# EAGLE design PCB1 (EAGLE 8.0.1)
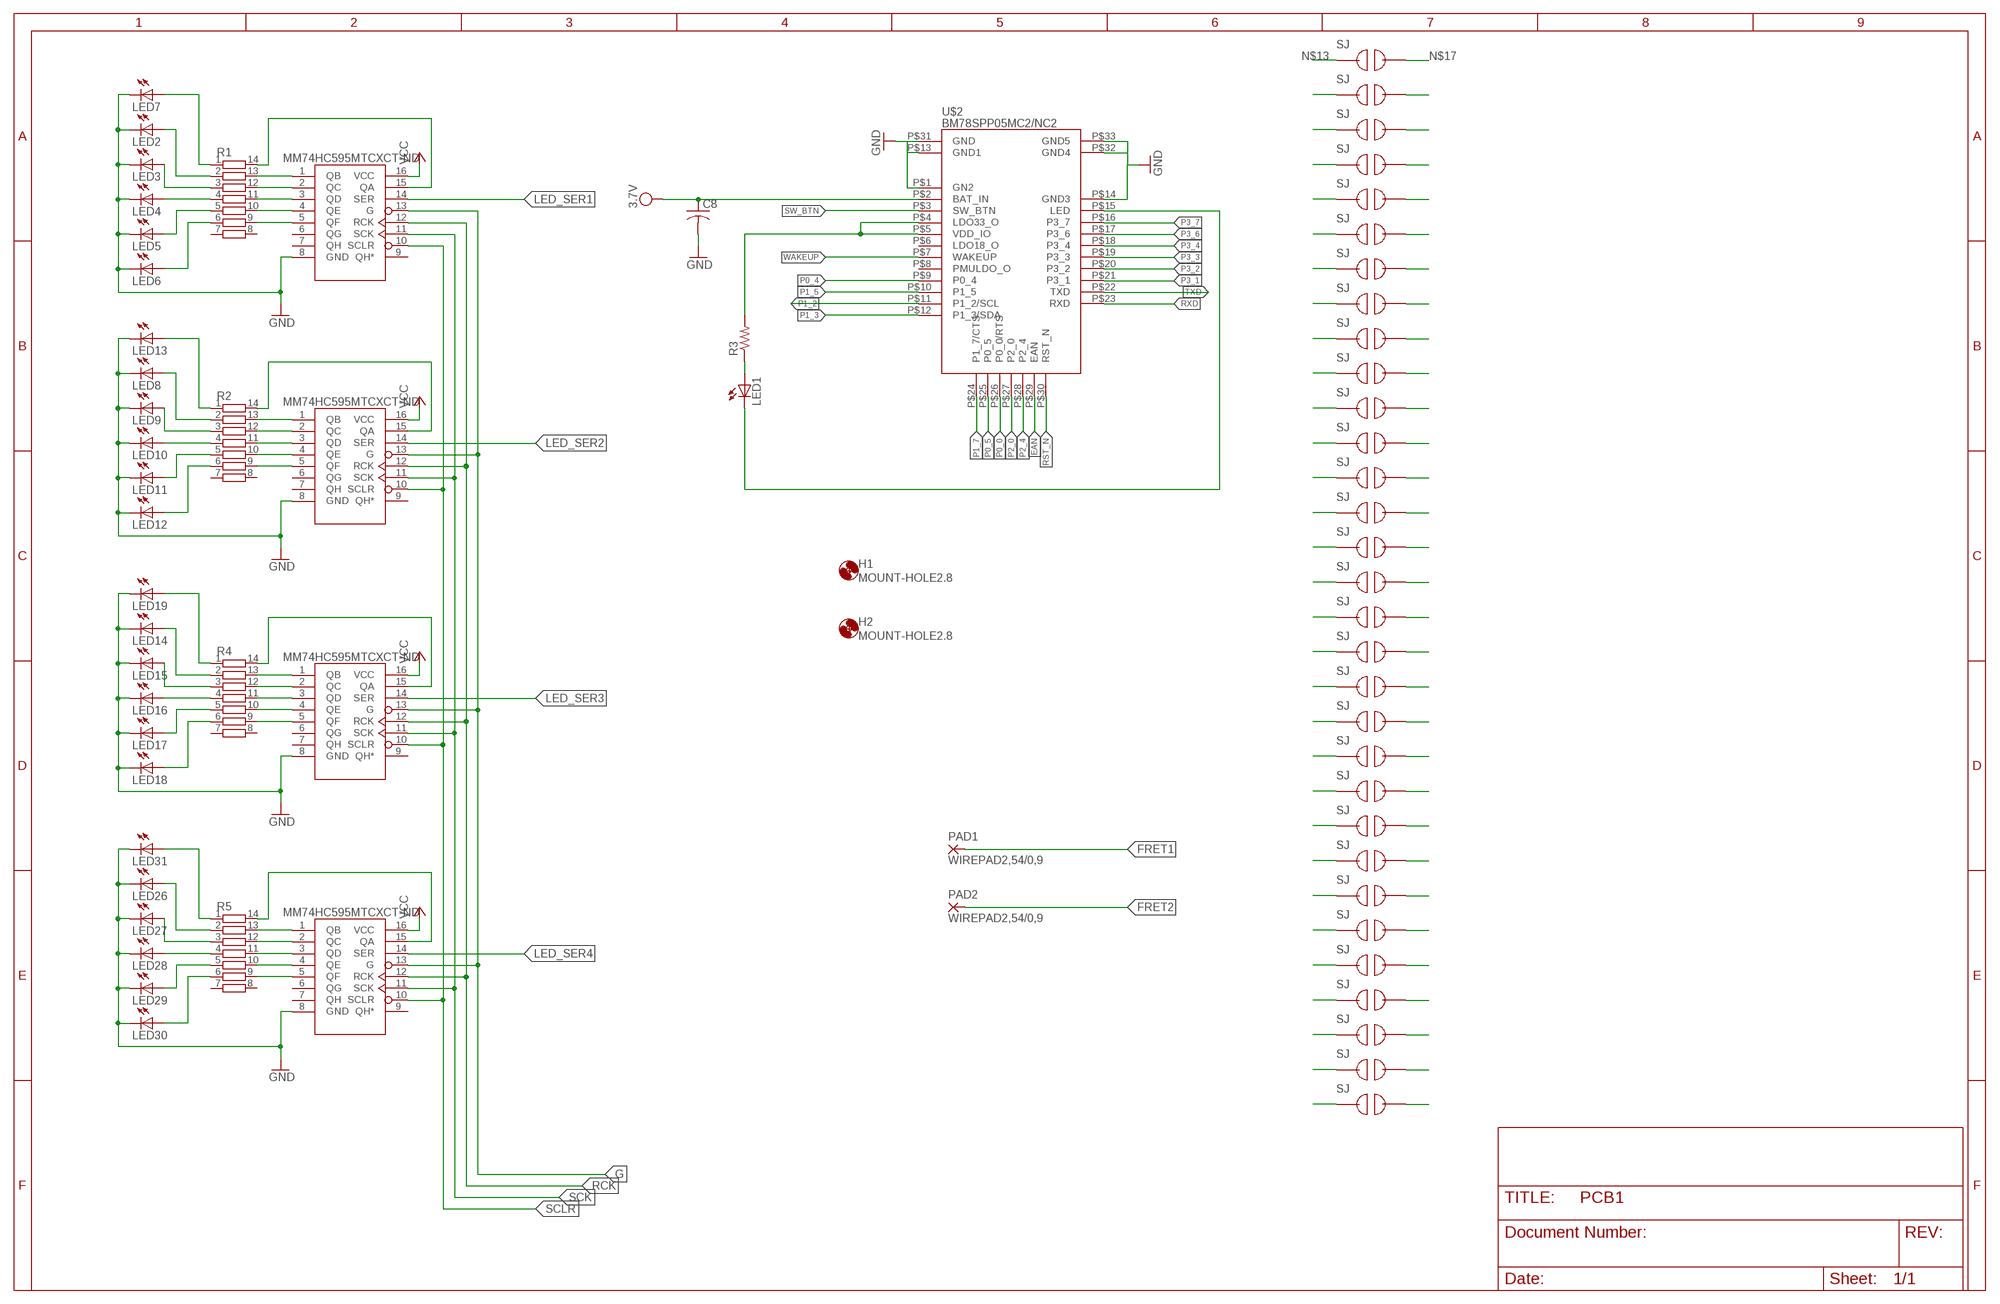
[diagram p0: schematic, sheet 1]

## Parts
C8  C-USC0805  [C0805]
H1  MOUNT-HOLE2.8  [2,8]
H2  MOUNT-HOLE2.8  [2,8]
LED1  LEDSMT1206  [1206]
LED2  LEDSMT1206  [1206]
LED3  LEDSMT1206  [1206]
LED4  LEDSMT1206  [1206]
LED5  LEDSMT1206  [1206]
LED6  LEDSMT1206  [1206]
LED7  LEDSMT1206  [1206]
LED8  LEDSMT1206  [1206]
LED9  LEDSMT1206  [1206]
LED10  LEDSMT1206  [1206]
LED11  LEDSMT1206  [1206]
LED12  LEDSMT1206  [1206]
LED13  LEDSMT1206  [1206]
LED14  LEDSMT1206  [1206]
LED15  LEDSMT1206  [1206]
LED16  LEDSMT1206  [1206]
LED17  LEDSMT1206  [1206]
LED18  LEDSMT1206  [1206]
LED19  LEDSMT1206  [1206]
LED26  LEDSMT1206  [1206]
LED27  LEDSMT1206  [1206]
LED28  LEDSMT1206  [1206]
LED29  LEDSMT1206  [1206]
LED30  LEDSMT1206  [1206]
LED31  LEDSMT1206  [1206]
PAD1  WIREPAD2,54/0,9  [2,54/0,9]
PAD2  WIREPAD2,54/0,9  [2,54/0,9]
R1  4814P-T01  [4814P]
R2  4814P-T01  [4814P]
R3  R-US_M0805  [M0805]
R4  4814P-T01  [4814P]
R5  4814P-T01  [4814P]
U$1  MM74HC595TSSOP-LD16  [MM74HC595MTCXCT-ND]
U$2  BM78SPP05MC2/NC2  [BM78SPP05MC2/NC2]
U$3  MM74HC595TSSOP-LD16  [MM74HC595MTCXCT-ND]
U$4  MM74HC595TSSOP-LD16  [MM74HC595MTCXCT-ND]
U$5  MM74HC595TSSOP-LD16  [MM74HC595MTCXCT-ND]
U$6  JUMPER  [JUMPER]
U$7  JUMPER  [JUMPER]
U$8  JUMPER  [JUMPER]
U$9  JUMPER  [JUMPER]
U$10  JUMPER  [JUMPER]
U$11  JUMPER  [JUMPER]
U$12  JUMPER  [JUMPER]
U$13  JUMPER  [JUMPER]
U$14  JUMPER  [JUMPER]
U$15  JUMPER  [JUMPER]
U$16  JUMPER  [JUMPER]
U$17  JUMPER  [JUMPER]
U$18  JUMPER  [JUMPER]
U$19  JUMPER  [JUMPER]
U$20  JUMPER  [JUMPER]
U$21  JUMPER  [JUMPER]
U$22  JUMPER  [JUMPER]
U$23  JUMPER  [JUMPER]
U$24  JUMPER  [JUMPER]
U$25  JUMPER  [JUMPER]
U$26  JUMPER  [JUMPER]
U$27  JUMPER  [JUMPER]
U$28  JUMPER  [JUMPER]
U$29  JUMPER  [JUMPER]
U$30  JUMPER  [JUMPER]
U$31  JUMPER  [JUMPER]
U$32  JUMPER  [JUMPER]
U$33  JUMPER  [JUMPER]
U$34  JUMPER  [JUMPER]
U$35  JUMPER  [JUMPER]
U$36  JUMPER  [JUMPER]

## Nets
EAN: U$2.P$29(EAN)
FRET1: PAD1.1(P)
FRET2: PAD2.1(P)
G: U$1.13(G) U$3.13(G) U$4.13(G) U$5.13(G)
GND: C8.2 LED2.C LED3.C LED4.C LED5.C LED6.C LED7.C LED8.C LED9.C LED10.C LED11.C LED12.C LED13.C LED14.C LED15.C LED16.C LED17.C LED18.C LED19.C LED26.C LED27.C LED28.C LED29.C LED30.C LED31.C U$1.8(GND) U$2.P$1(GN2) U$2.P$13(GND1) U$2.P$14(GND3) U$2.P$31(GND) U$2.P$32(GND4) U$2.P$33(GND5) U$3.8(GND) U$4.8(GND) U$5.8(GND)
LED: LED1.C U$2.P$15(LED)
LED_SER1: U$4.14(SER)
LED_SER2: U$1.14(SER)
LED_SER3: U$3.14(SER)
LED_SER4: U$5.14(SER)
N$1: R1.13 U$4.1(QB)
N$2: R1.12 U$4.2(QC)
N$3: R1.11 U$4.3(QD)
N$4: R1.10 U$4.4(QE)
N$5: R1.9 U$4.5(QF)
N$6: LED7.A R1.1
N$7: R1.14 U$4.15(QA)
N$8: LED2.A R1.2
N$9: LED3.A R1.3
N$10: LED4.A R1.4
N$11: LED5.A R1.5
N$12: LED6.A R1.6
N$13: U$35.P$1
N$15: LED1.A R3.1
N$16: R3.2 U$2.P$4(LDO33_O) U$2.P$5(VDD_IO)
N$17: U$35.P$2
N$18: U$34.P$1
N$19: R2.13 U$1.1(QB)
N$20: R2.12 U$1.2(QC)
N$21: R2.11 U$1.3(QD)
N$22: R2.10 U$1.4(QE)
N$23: R2.9 U$1.5(QF)
N$24: R2.14 U$1.15(QA)
N$25: LED13.A R2.1
N$26: LED8.A R2.2
N$27: LED9.A R2.3
N$28: LED10.A R2.4
N$29: LED11.A R2.5
N$30: LED12.A R2.6
N$31: U$34.P$2
N$32: U$33.P$2
N$33: U$33.P$1
N$34: U$6.P$1
N$35: R4.13 U$3.1(QB)
N$36: R4.12 U$3.2(QC)
N$37: R4.11 U$3.3(QD)
N$38: R4.10 U$3.4(QE)
N$39: R4.9 U$3.5(QF)
N$40: R4.14 U$3.15(QA)
N$41: LED19.A R4.1
N$42: U$7.P$1
N$43: LED14.A R4.2
N$44: LED15.A R4.3
N$45: U$8.P$1
N$46: LED16.A R4.4
N$47: LED17.A R4.5
N$49: LED18.A R4.6
N$50: U$9.P$1
N$52: U$6.P$2
N$53: U$7.P$2
N$54: U$8.P$2
N$55: U$9.P$2
N$56: U$10.P$1
N$57: U$11.P$1
N$58: U$10.P$2
N$59: U$11.P$2
N$60: R5.13 U$5.1(QB)
N$61: R5.12 U$5.2(QC)
N$62: R5.11 U$5.3(QD)
N$63: R5.10 U$5.4(QE)
N$64: R5.9 U$5.5(QF)
N$65: U$12.P$2
N$66: R5.14 U$5.15(QA)
N$67: LED31.A R5.1
N$68: LED26.A R5.2
N$69: LED27.A R5.3
N$70: LED28.A R5.4
N$71: LED29.A R5.5
N$72: LED30.A R5.6
N$73: U$12.P$1
N$74: U$13.P$1
N$75: U$13.P$2
N$76: U$14.P$2
N$77: U$14.P$1
N$78: U$15.P$1
N$79: U$15.P$2
N$80: U$16.P$2
N$81: U$17.P$2
N$82: U$18.P$2
N$83: U$19.P$2
N$84: U$20.P$2
N$85: U$21.P$2
N$86: U$22.P$2
N$87: U$23.P$2
N$88: U$24.P$2
N$89: U$25.P$2
N$90: U$26.P$2
N$91: U$27.P$2
N$92: U$28.P$2
N$93: U$29.P$2
N$94: U$30.P$2
N$95: U$31.P$2
N$96: U$32.P$2
N$97: U$36.P$2
N$98: U$36.P$1
N$99: U$32.P$1
N$100: U$31.P$1
N$101: U$30.P$1
N$102: U$29.P$1
N$103: U$28.P$1
N$104: U$27.P$1
N$105: U$26.P$1
N$106: U$25.P$1
N$107: U$24.P$1
N$108: U$23.P$1
N$109: U$22.P$1
N$110: U$21.P$1
N$111: U$20.P$1
N$112: U$19.P$1
N$113: U$18.P$1
N$114: U$17.P$1
N$115: U$16.P$1
P0_0: U$2.P$26(P0_0/RTS)
P0_4: U$2.P$9(P0_4)
P0_5: U$2.P$25(P0_5)
P1_2: U$2.P$11(P1_2/SCL)
P1_3: U$2.P$12(P1_3/SDA)
P1_5: U$2.P$10(P1_5)
P1_7: U$2.P$24(P1_7/CTS)
P2_0: U$2.P$27(P2_0)
P2_4: U$2.P$28(P2_4)
P3_1: U$2.P$21(P3_1)
P3_2: U$2.P$20(P3_2)
P3_3: U$2.P$19(P3_3)
P3_4: U$2.P$18(P3_4)
P3_6: U$2.P$17(P3_6)
P3_7: U$2.P$16(P3_7)
RCK: U$1.12(RCK) U$3.12(RCK) U$4.12(RCK) U$5.12(RCK)
RST_N: U$2.P$30(RST_N)
RXD: U$2.P$23(RXD)
SCK: U$1.11(SCK) U$3.11(SCK) U$4.11(SCK) U$5.11(SCK)
SCLR: U$1.10(SCLR) U$3.10(SCLR) U$4.10(SCLR) U$5.10(SCLR)
SW_BTN: U$2.P$3(SW_BTN)
TXD: U$2.P$22(TXD)
VCC: U$1.16(VCC) U$3.16(VCC) U$4.16(VCC) U$5.16(VCC)
VDD: C8.1 U$2.P$2(BAT_IN) ; supply symbol labelled 3.7V
WAKEUP: U$2.P$7(WAKEUP)
Unconnected: R1.7 R1.8 R2.7 R2.8 R4.7 R4.8 R5.7 R5.8 U$1.6(QG) U$1.7(QH) U$1.9(QH*) U$2.P$6(LDO18_O) U$2.P$8(PMULDO_O) U$3.6(QG) U$3.7(QH) U$3.9(QH*) U$4.6(QG) U$4.7(QH) U$4.9(QH*) U$5.6(QG) U$5.7(QH) U$5.9(QH*)

## Library data of the parts
C8 = rcl:C-US: CAPACITOR, American symbol
H1 H2 = holes:MOUNT-HOLE: MOUNTING HOLE with drill center marker
LED1-LED19 LED26-LED31 = led:LED: LED OSRAM: - CHIPLED LG R971, LG N971, LY N971, LG Q971, LY Q971, LO R971, LY R971 LH N974, LH R974 LS Q976, LO Q976, LY Q976 LO Q996 - Hyper CHIPLED LW Q18S LB Q993, LB Q99A, LB R99A - SideLED LS A670, LO A670, LY A670, LG A670, LP A670 LB A673, LV A673, LT A673, LW A673 LH A674 LY A675 LS A676, LA A676, LO A676, LY A676, LW A676 LS A679, LY A679, LG A679 - Hyper Micro SIDELED® LS Y876, LA Y876, LO Y876, LY Y876 LT Y87S - SmartLED LW L88C, LW L88S LB L89C, LB L89S, LG L890 LS L89K, LO L89K, LY L89K LS L896, LA L896, LO L896, LY L896 - TOPLED LS T670, LO T670, LY T670, LG T670, LP T670 LSG T670, LSP T670, LSY T670, LOP T670, LYG T670 LG T671, LOG T671, LSG T671 LB T673, LV T673, LT T673, LW T673 LH T674 LS T676, LA T676, LO T676, LY T676, LB T676, LH T676, LSB T676, LW T676 LB T67C, LV T67C, LT T67C, LS T67K, LO T67K, LY T67K, LW E67C LS E67B, LA E67B, LO E67B, LY E67B, LB E67C, LV E67C, LT E67C LW T67C LS T679, LY T679, LG T679 LS T770, LO T770, LY T770, LG T770, LP T770 LB T773, LV T773, LT T773, LW T773 LH T774 LS E675, LA E675, LY E675, LS T675 LS T776, LA T776, LO T776, LY T776, LB T776 LHGB T686 LT T68C, LB T68C - Hyper Mini TOPLED® LB M676 - Mini TOPLED Santana® LG M470 LS M47K, LO M47K, LY M47K Source: http://www.osram.convergy.de LUXEON: - LUMILED® LXK2-PW12-R00, LXK2-PW12-S00, LXK2-PW14-U00, LXK2-PW14-V00 LXK2-PM12-R00, LXK2-PM12-S00, LXK2-PM14-U00 LXK2-PE12-Q00, LXK2-PE12-R00, LXK2-PE12-S00, LXK2-PE14-T00, LXK2-PE14-U00 LXK2-PB12-K00, LXK2-PB12-L00, LXK2-PB12-M00, LXK2-PB14-N00, LXK2-PB14-P00, LXK2-PB14-Q00 LXK2-PR12-L00, LXK2-PR12-M00, LXK2-PR14-Q00, LXK2-PR14-R00 LXK2-PD12-Q00, LXK2-PD12-R00, LXK2-PD12-S00 LXK2-PH12-R00, LXK2-PH12-S00 LXK2-PL12-P00, LXK2-PL12-Q00, LXK2-PL12-R00 Source: www.luxeon.com KINGBRIGHT: KA-3528ASYC Source: www.kingbright.com
PAD1 PAD2 = wirepad:WIREPAD: Wire PAD connect wire on PCB
R1 R2 R4 R5 = resistor-bourns:4814P-T01: BOURNS RESISTOR NETWORK; MF: BOURNS, INC.; MPN: 4814P-T01-104LF; OC_FARNELL: 9357386; OC_NEWARK: 33K0526
R3 = rcl:R-US_: RESISTOR, American symbol
U$1 U$3-U$5 = ECE477_Guitutar:MM74HC595
U$2 = ECE477_Guitutar:BM78SPP05MC2/NC2
U$6-U$36 = ECE477_Guitutar:JUMPER

## Board
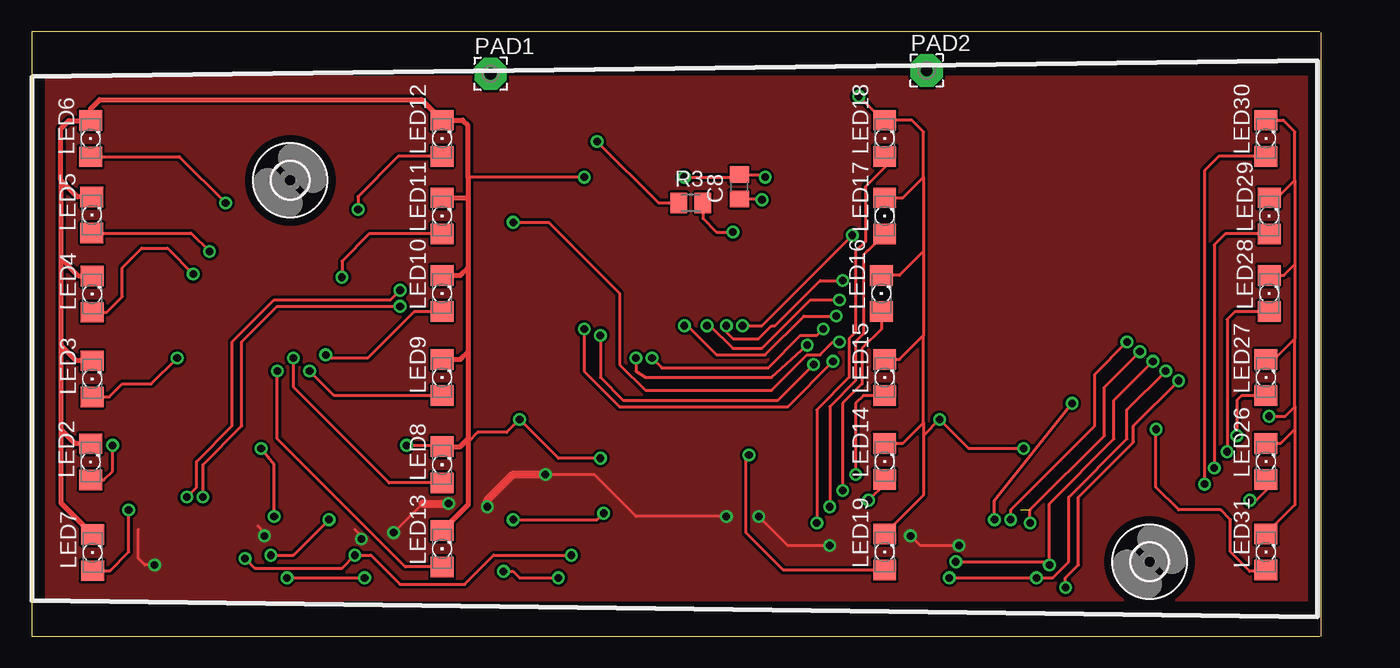
[diagram p1: board, top side]
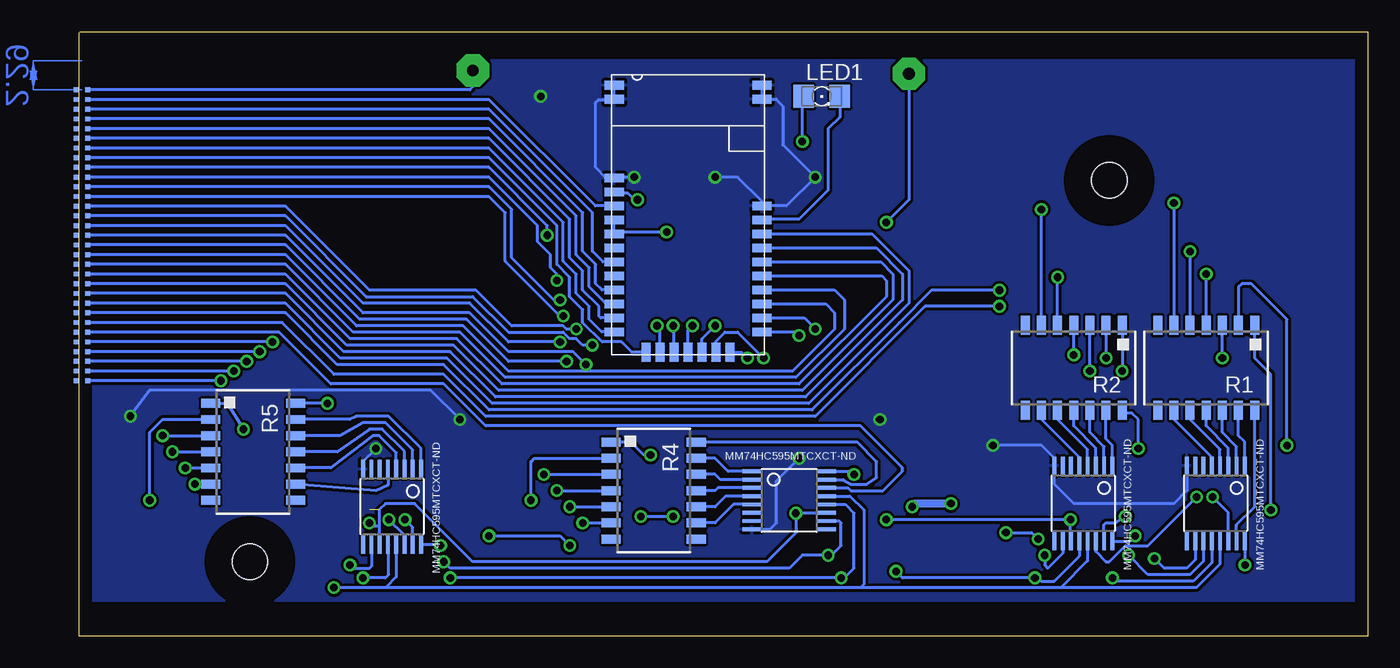
[diagram p2: board, bottom side, seen from below]

Size 101.36 x 47.49 mm. Coordinates in mm from the lower left corner, seen from the top.
Outline: 101.27,0 0,0 0,47.49 101.27,47.49
Outline: 101.34,47.42 101.36,0
Copper layers (1*16): Top 0.035mm / dielectric 1.5mm / Bottom 0.035mm
Design rules "default": minimum track width 10mil, minimum drill 24mil, track to track 8mil, track to pad 8mil, pad to pad 8mil, via to via 8mil, smd to smd 8mil, copper to edge 40mil, drill to drill 8mil, minimum pad ring 10mil, minimum via ring 8mil, stop-mask expansion 4mil, vias tented up to drill 0mil, thermal gap 10mil

### Footprints (pad centres in the part's own frame; a part is rotated, then mirrored left to right if it is on the bottom)
C0805 = smd 1.3 x 1.5: 1 -0.95,0; 2 0.95,0
2,8 = hole 2.8: 0,0
1206 = smd 1.6 x 1.803: A -1.422,0; C 1.422,0
2,54/0,9 = drill 0.914 pad 2.54 octagon: 1 0,0
4814P = smd 0.7 x 1.5: 1 -3.81,-3.346; 2 -2.54,-3.346; 3 -1.27,-3.346; 4 0,-3.346; 5 1.27,-3.346; 6 2.54,-3.346; 7 3.81,-3.346; 8 3.81,3.346; 9 2.54,3.346; 10 1.27,3.346; 11 0,3.346; 12 -1.27,3.346; 13 -2.54,3.346; 14 -3.81,3.346
M0805 = smd 1.3 x 1.6: 1 -0.95,0; 2 0.95,0
MM74HC595MTCXCT-ND = smd 0.3 x 1.45: 1 -2.275,-2.95; 2 -1.625,-2.95; 3 -0.975,-2.95; 4 -0.325,-2.95; 5 0.325,-2.95; 6 0.975,-2.95; 7 1.625,-2.95; 8 2.275,-2.95; 9 2.275,2.95; 10 1.625,2.95; 11 0.975,2.95; 12 0.325,2.95; 13 -0.325,2.95; 14 -0.975,2.95; 15 -1.625,2.95; 16 -2.275,2.95
BM78SPP05MC2/NC2 = smd 1.5 x 0.7: P$1 0.2,13.9; P$2 0.2,12.8; P$3 0.2,11.7; P$4 0.2,10.6; P$5 0.2,9.5; P$6 0.2,8.4; P$7 0.2,7.3; P$8 0.2,6.2; P$9 0.2,5.1; P$10 0.2,4; P$11 0.2,2.9; P$12 0.2,1.8; P$13 0.2,20.1; P$14 11.8,11.7; P$15 11.8,10.6; P$16 11.8,9.5; P$17 11.8,8.4; P$18 11.8,7.3; P$19 11.8,6.2; P$20 11.8,5.1; P$21 11.8,4; P$22 11.8,2.9; P$23 11.8,1.8; P$31 0.2,21.2; P$32 11.8,20.1; P$33 11.8,21.2 | smd 0.7 x 1.5: P$24 2.7,0.2; P$25 3.8,0.2; P$26 4.9,0.2; P$27 6,0.2; P$28 7.1,0.2; P$29 8.2,0.2; P$30 9.3,0.2
JUMPER = smd 0.381 x 0.381: P$1 -0.454,0; P$2 0.454,0

### Placement (x,y rotation side)
C8  55.63,35.31 90 top
H1  20.32,35.81 0 top
H2  87.88,5.84 0 top
LED1  42.93,42.42 0 bottom
LED2  4.62,13.69 90 top
LED3  4.75,20.22 90 top
LED4  4.75,26.87 90 top
LED5  4.72,33.1 90 top
LED6  4.62,39.09 90 top
LED7  4.78,6.55 90 top
LED8  32.26,13.46 90 top
LED9  32.26,20.32 90 top
LED10  32.26,26.92 90 top
LED11  32.26,33.02 90 top
LED12  32.26,39.12 90 top
LED13  32.26,6.86 90 top
LED14  67.06,13.72 90 top
LED15  67.06,20.32 90 top
LED16  66.8,26.92 90 top
LED17  67.06,33.02 90 top
LED18  67.06,39.12 90 top
LED19  67.06,6.6 90 top
LED26  97.03,13.72 90 top
LED27  97.03,20.32 90 top
LED28  97.28,26.92 90 top
LED29  97.28,33.02 90 top
LED30  97.03,39.12 90 top
LED31  97.03,6.6 90 top
PAD1  36.07,44.2 0 top
PAD2  70.36,44.45 0 top
R1  12.7,21.08 180 bottom
R2  23.11,21.08 180 bottom
R3  51.82,34.04 0 top
R4  56.13,11.43 270 bottom
R5  87.63,14.48 270 bottom
U$1  22.35,10.41 180 bottom
U$2  59.44,22.1 0 bottom
U$3  45.47,10.67 270 bottom
U$4  11.94,10.41 180 bottom
U$5  76.71,10.16 180 bottom
U$6  101.09,42.93 0 bottom
U$7  101.09,42.16 0 bottom
U$8  101.09,41.4 0 bottom
U$9  101.09,40.64 0 bottom
U$10  101.09,39.88 0 bottom
U$11  101.09,39.12 0 bottom
U$12  101.09,38.35 0 bottom
U$13  101.09,37.59 0 bottom
U$14  101.09,36.83 0 bottom
U$15  101.09,36.07 0 bottom
U$16  101.09,35.31 0 bottom
U$17  101.09,34.54 0 bottom
U$18  101.09,33.78 0 bottom
U$19  101.09,33.02 0 bottom
U$20  101.09,32.26 0 bottom
U$21  101.09,31.5 0 bottom
U$22  101.09,30.73 0 bottom
U$23  101.09,29.97 0 bottom
U$24  101.09,29.21 0 bottom
U$25  101.09,28.45 0 bottom
U$26  101.09,27.69 0 bottom
U$27  101.09,26.92 0 bottom
U$28  101.09,26.16 0 bottom
U$29  101.09,25.4 0 bottom
U$30  101.09,24.64 0 bottom
U$31  101.09,23.88 0 bottom
U$32  101.09,23.11 0 bottom
U$33  101.09,22.35 0 bottom
U$34  101.09,21.59 0 bottom
U$35  101.09,20.83 0 bottom
U$36  101.09,20.07 0 bottom

### Tracks (layer width: path | path; a pad name or v marks a point on that pad's centre or on a via)
EAN  (via drill 0.6)
  Top 0.254: v47.5,21.84 47.5,20.83 48.26,20.32 58.17,20.32 v60.96,22.86
  Bottom 0.254: U$2.P$29 51.24,23.19 50.55,23.88 49.53,23.88 v47.5,21.84 | 100.58,33.02 85.09,33.02 78.74,26.67 70.36,26.67 67.56,23.88 63.25,23.88 62.74,23.37 62.23,23.37 61.72,22.86 v60.96,22.86
FRET1  (via drill 0.6)
  Top 0.254: v37.85,32.51 40.64,32.51 46.23,26.92 46.23,21.34 48.26,19.3 58.17,19.3 60.96,22.1 61.98,22.1 62.99,23.11 v63.5,23.11
  Bottom 0.254: PAD1.1 36.07,34.29 v37.85,32.51 | v63.5,23.11 67.56,23.11 70.61,26.16 78.99,26.16 85.09,32.26 100.58,32.26
FRET2
  Bottom 0.254: PAD2.1 70.36,43.18 70.61,42.93 100.58,42.93
G  (via drill 0.6)
  Top 0.254: v81.28,3.81 81.28,4.57 82.3,5.59 82.3,10.92 86.61,15.24 86.61,16.51 v90.17,20.07
  Bottom 0.254: U$4.13 11.61,5.66 13.46,3.81 24.13,3.81 | U$1.13 22.03,5.91 24.13,3.81 | U$3.13 40.71,10.99 39.62,9.91 39.62,4.06 39.88,3.81 | 24.13,3.81 39.88,3.81 | 39.88,3.81 77.22,3.81 | U$5.13 76.38,4.64 77.22,3.81 | v90.17,20.07 100.58,20.07 | 77.22,3.81 v81.28,3.81
GND  (via drill 0.6)
  Top 0.254: 70.1,16.76 70.1,23.62 | 70.1,30.23 70.1,23.62 | 70.1,36.07 70.1,30.23 | 70.1,36.07 70.1,39.62 69.19,40.54 LED18.C 66.9,40.54 v65.02,42.42 | 70.1,16.76 70.1,15.75 | 70.1,15.75 70.1,11.07 LED19.C | LED14.C 68.48,15.14 70.1,16.76 | LED15.C 68.22,21.74 70.1,23.62 | LED16.C 68.22,28.35 70.1,30.23 | LED17.C 68.48,34.44 70.1,36.07 | v57.66,36.07 57.47,36.26 C8.2 55.44,36.07 v51.31,36.07 | v43.43,36.07 34.29,36.07 | v29.46,14.99 32.16,14.99 LED8.C | v44.7,13.97 41.4,13.97 v38.35,17.02 37.34,16 35.05,16 34.29,15.24 | LED30.C 98.4,40.54 99.31,39.62 99.31,35.81 | 99.31,18.03 99.31,23.37 | 99.31,18.03 99.31,16.26 | 99.31,29.21 99.31,23.37 | 99.31,35.81 99.31,29.21 | 99.31,16.26 99.31,10.31 LED31.C | LED26.C 98.2,15.14 99.31,16.26 | LED27.C 97.69,21.74 99.31,23.37 | LED28.C 98.45,28.35 99.31,29.21 | LED29.C 97.94,34.44 99.31,35.81 | v97.28,17.27 98.55,17.27 99.31,18.03 | 70.1,15.75 v71.37,17.02 73.66,14.73 v77.98,14.73
  Top 0.406: 2.29,22.86 2.29,16.26 | 2.29,29.72 2.29,22.86 | 2.29,35.81 2.29,29.72 | 2.29,35.81 2.29,39.88 2.92,40.51 LED6.C 4.62,41.45 5.33,42.16 30.63,42.16 LED12.C 33.88,40.54 34.29,40.13 34.29,36.07 34.29,34.29 | 2.29,16.26 2.29,10.46 LED7.C | LED2.C 3.43,15.11 2.29,16.26 | LED3.C 3.51,21.64 2.29,22.86 | LED4.C 3.71,28.3 2.29,29.72 | LED5.C 3.58,34.52 2.29,35.81 | 34.29,22.35 34.29,15.49 | 34.29,28.96 34.29,22.35 | 34.29,34.29 34.29,28.96 | 34.29,15.49 34.29,15.24 34.29,10.31 LED13.C | LED8.C 33.68,14.88 34.29,15.49 | LED9.C 33.68,21.74 34.29,22.35 | LED10.C 33.68,28.35 34.29,28.96 | LED11.C 34.14,34.44 34.29,34.29
  Bottom 0.254: U$4.8 14.21,11.44 15.24,10.41 23.11,10.41 24.64,11.94 U$1.8 24.63,13.96 25.65,14.99 v29.46,14.99 | v57.66,36.07 59.17,36.07 U$2.P$1 59.87,36 60.71,36.83 60.71,41.91 60.45,42.16 59.27,42.16 U$2.P$13 U$2.P$31 | U$2.P$33 U$2.P$32 46.52,42.2 45.97,41.66 45.97,38.61 v43.43,36.07 45.7,33.8 U$2.P$14 47.64,34.17 49.53,36.07 v51.31,36.07 | U$3.8 46.98,8.39 46.48,8.89 46.48,12.19 v44.7,13.97 | U$5.8 78.98,13.73 v77.98,14.73 | v97.28,17.27 95.76,19.3 73.66,19.3 v71.37,17.02
  pour Bottom: 0,45.21 101.09,45.21 101.09,2.79 0,2.79
LED
  Bottom 0.254: LED1.C 41.5,40.79 42.42,39.88 42.42,35.05 44.7,32.77 47.57,32.77 U$2.P$15
LED_SER1  (via drill 0.6)
  Top 0.254: v12.19,10.92 12.95,11.68 12.95,13.72 15.75,16.51 15.75,23.11 19.05,26.42 28.19,26.42 v28.96,27.18
  Bottom 0.254: U$4.14 10.96,9.69 v12.19,10.92 | v28.96,27.18 34.29,27.18 36.83,24.64 43.69,17.78 69.09,17.78 72.64,21.34 81.03,21.34 85.09,25.4 100.58,25.4
LED_SER2  (via drill 0.6)
  Top 0.254: v13.46,10.92 13.46,13.46 16.51,16.51 16.51,23.11 19.3,25.91 v28.96,25.91
  Bottom 0.254: U$1.14 21.38,6.64 20.57,5.84 20.32,5.84 19.05,7.11 17.27,7.11 v13.46,10.92 | v28.96,25.91 34.8,25.91 43.43,17.27 69.34,17.27 72.64,20.57 81.28,20.57 85.34,24.64 100.58,24.64
LED_SER3
  Bottom 0.254: U$3.14 40.85,11.64 40.64,11.43 38.1,11.43 36.58,12.95 36.58,13.21 39.88,16.51 69.34,16.51 72.64,19.81 81.53,19.81 85.6,23.88 100.58,23.88
LED_SER4  (via drill 0.6)
  Top 0.254: v76.96,9.14 76.96,9.91 83.57,16.51 83.57,20.57 v86.11,23.11
  Bottom 0.254: U$5.14 75.73,7.92 v76.96,9.14 | v86.11,23.11 100.58,23.11
N$1
  Bottom 0.254: U$4.1 9.66,15.25 10.16,15.75 R1.13
N$2
  Bottom 0.254: U$4.2 10.31,14.88 11.43,16 R1.12
N$3
  Bottom 0.254: U$4.3 10.96,14.77 12.7,16.51 R1.11
N$4
  Bottom 0.254: U$4.4 11.61,14.66 13.97,17.02 R1.10
N$5
  Bottom 0.254: U$4.5 12.26,14.04 15.24,17.02 R1.9
N$6  (via drill 0.6)
  Top 0.254: LED7.A 6.15,5.13 7.62,6.6 v7.62,9.91
  Bottom 0.254: v7.62,9.91 7.62,20.57 8.89,21.84 R1.1
N$7
  Bottom 0.254: U$4.15 10.31,8.74 8.89,10.16 R1.14
N$8  (via drill 0.6)
  Top 0.254: LED2.A 5.67,12.27 6.35,12.95 v6.35,14.99
  Bottom 0.254: v6.35,14.99 6.35,24.89 9.14,27.69 9.91,27.69 10.16,27.43 R1.2
N$9  (via drill 0.6)
  Top 0.254: LED3.A 6.1,18.8 7.11,19.81 9.4,19.81 v11.43,21.84
  Bottom 0.254: v11.43,21.84 R1.3
N$10  (via drill 0.6)
  Top 0.254: LED4.A 5.89,25.45 7.11,26.67 7.11,28.96 8.64,30.48 10.67,30.48 v12.7,28.45
  Bottom 0.254: R1.4 v12.7,28.45
N$11  (via drill 0.6)
  Top 0.254: LED5.A 12.52,31.67 v13.97,30.23
  Bottom 0.254: v13.97,30.23 R1.5
N$12  (via drill 0.6)
  Top 0.254: LED6.A 11.61,37.67 v15.24,34.04
  Bottom 0.254: v15.24,34.04 R1.6
N$15  (via drill 0.6)
  Top 0.254: v44.45,38.86 49.28,34.04 R3.1
  Bottom 0.254: v44.45,38.86 44.45,42.32 LED1.A
N$16  (via drill 0.6)
  Top 0.254: R3.2 52.77,32.83 53.85,31.75 v55.12,31.75
  Bottom 0.254: U$2.P$4 U$2.P$5 59.08,31.75 v55.12,31.75
N$19
  Bottom 0.254: U$1.1 20.08,15 20.57,15.49 R2.13
N$20
  Bottom 0.254: U$1.2 20.73,14.88 21.84,16 R2.12
N$21
  Bottom 0.254: U$1.3 21.38,14.77 23.11,16.51 R2.11
N$22
  Bottom 0.254: U$1.4 22.03,14.66 24.38,17.02 R2.10
N$23
  Bottom 0.254: U$1.5 22.68,14.04 25.65,17.02 R2.9
N$24  (via drill 0.6)
  Top 0.254: v19.05,9.4 19.05,13.46 v18.03,14.73
  Bottom 0.254: U$1.15 20.73,8.74 20.57,8.89 19.81,8.89 v19.05,9.4 | v18.03,14.73 18.03,17.02 18.54,17.53 19.09,17.53 R2.14
N$25  (via drill 0.6)
  Top 0.254: LED13.A 29.36,5.44 19.3,15.49 v19.3,20.83
  Bottom 0.254: R2.1 v19.3,20.83
N$26  (via drill 0.6)
  Top 0.254: LED8.A 28.09,12.04 20.57,19.56 v20.57,21.84
  Bottom 0.254: R2.2 v20.57,21.84
N$27  (via drill 0.6)
  Top 0.254: LED9.A 23.77,18.9 v21.84,20.83
  Bottom 0.254: v21.84,20.83 R2.3
N$28  (via drill 0.6)
  Top 0.254: LED10.A 30.07,25.5 26.42,21.84 23.37,21.84 v23.11,22.1
  Bottom 0.254: v23.11,22.1 R2.4
N$29  (via drill 0.6)
  Top 0.254: LED11.A 26.52,31.6 24.38,29.46 v24.38,28.19
  Bottom 0.254: R2.5 v24.38,28.19
N$30  (via drill 0.6)
  Top 0.254: LED12.A 28.8,37.69 25.65,34.54 v25.65,33.53
  Bottom 0.254: R2.6 v25.65,33.53
N$35
  Bottom 0.254: U$3.1 50.28,12.94 51.31,13.97 R4.13
N$36
  Bottom 0.254: U$3.2 50.9,12.29 51.31,12.7 R4.12
N$37
  Bottom 0.254: U$3.3 51.09,11.64 51.31,11.43 R4.11
N$38
  Bottom 0.254: U$3.4 50.48,10.99 51.31,10.16 R4.10
N$39
  Bottom 0.254: U$3.5 49.85,10.34 51.31,8.89 R4.9
N$40
  Bottom 0.254: U$3.15 41.25,12.29 40.64,11.94 39.37,11.94 38.61,12.45 38.61,13.72 40.13,15.24 R4.14
N$41  (via drill 0.6)
  Top 0.254: LED19.A 59.08,5.18 56.13,8.13 56.13,13.97 v56.39,14.22
  Bottom 0.254: v56.39,14.22 56.9,14.22 57.91,15.24 R4.1
N$43  (via drill 0.6)
  Top 0.254: LED14.A 67.06,11.94 v65.79,10.67
  Bottom 0.254: v65.79,10.67 65.79,13.72 65.53,13.97 R4.2
N$44  (via drill 0.6)
  Top 0.254: LED15.A 65.38,18.9 64.77,18.29 v64.77,12.7
  Bottom 0.254: v64.77,12.7 R4.3
N$46  (via drill 0.6)
  Top 0.254: v63.75,11.43 63.75,18.29 65.28,19.81 65.28,22.61 66.8,24.13 LED16.A
  Bottom 0.254: v63.75,11.43 R4.4
N$47  (via drill 0.6)
  Top 0.254: v62.74,10.16 62.74,18.03 64.77,20.07 64.77,23.11 65.41,23.75 65.41,29.97 65.79,30.35 65.81,30.35 LED17.A
  Bottom 0.254: v62.74,10.16 R4.5
N$49  (via drill 0.6)
  Top 0.254: v61.72,8.89 61.72,17.78 64.26,20.32 64.26,23.37 64.77,23.88 64.77,30.23 65.53,30.99 65.53,35.31 67.06,36.83 | 67.06,36.83 LED18.A 67.06,36.83
  Bottom 0.254: v61.72,8.89 R4.6
N$60
  Bottom 0.254: U$5.1 74.43,14.74 76.96,17.27 79.5,17.27 80.01,17.02 R5.13
N$61
  Bottom 0.254: U$5.2 75.08,14.63 77.22,16.76 78.99,16.76 80.77,15.75 R5.12
N$62
  Bottom 0.254: U$5.3 75.73,14.52 77.47,16.26 78.49,16.26 81.03,14.48 R5.11
N$63
  Bottom 0.254: U$5.4 76.38,14.41 77.72,15.75 78.23,15.75 81.53,13.21 R5.10
N$64
  Bottom 0.254: U$5.5 77.03,11.87 77.98,11.43 R5.9
N$66  (via drill 0.6)
  Top 0.254: v75.69,9.14 75.69,10.67 v81.79,18.29
  Bottom 0.254: U$5.15 75.08,8.54 v75.69,9.14 | v81.79,18.29 R5.14
N$67  (via drill 0.6)
  Top 0.254: LED31.A 96.93,5.08 95.76,5.08 94.23,6.6 94.23,9.14 93.47,9.91 90.17,9.91 88.39,11.68 v88.39,16.26
  Bottom 0.254: R5.1 89.66,18.29 v88.39,16.26
N$68  (via drill 0.6)
  Top 0.254: LED26.A 97.03,11.43 96.27,10.67 v95.76,10.67
  Bottom 0.254: v95.76,10.67 95.76,16 94.74,17.02 R5.2
N$69  (via drill 0.6)
  Top 0.254: LED27.A 95.1,18.9 94.74,18.54 v94.74,15.75
  Bottom 0.254: v94.74,15.75 R5.3
N$70  (via drill 0.6)
  Top 0.254: LED28.A 94.59,25.5 93.98,24.89 v93.98,14.48
  Bottom 0.254: v93.98,14.48 R5.4
N$71  (via drill 0.6)
  Top 0.254: LED29.A 93.83,31.6 92.96,30.73 v92.96,13.21
  Bottom 0.254: v92.96,13.21 R5.5
N$72  (via drill 0.6)
  Top 0.254: LED30.A 93.32,37.69 92.2,36.58 v92.2,11.94
  Bottom 0.254: v92.2,11.94 R5.6
P0_0  (via drill 0.6)
  Top 0.254: v54.61,24.38 54.61,23.88 55.12,23.37 57.15,23.37 58.17,24.38 58.42,24.38 61.98,27.94 v63.75,27.94
  Bottom 0.254: U$2.P$26 54.54,24.31 v54.61,24.38 | v63.75,27.94 63.75,28.45 64.26,28.96 64.26,29.97 65.28,30.99 65.28,32.26 69.09,36.07 100.58,36.07
P0_4
  Bottom 0.254: U$2.P$9 60.22,27.2 60.71,27.69 60.71,29.21 61.72,30.23 61.72,33.27 69.09,40.64 100.58,40.64
P0_5  (via drill 0.6)
  Top 0.254: v55.88,24.38 57.4,24.38 v64.52,31.5
  Bottom 0.254: U$2.P$25 55.64,24.14 v55.88,24.38 | v64.52,31.5 64.52,32.26 69.09,36.83 100.58,36.83
P1_2
  Bottom 0.254: U$2.P$11 60.3,25 60.45,25.15 60.45,25.91 61.72,27.18 61.72,28.7 62.74,29.72 62.74,32.77 69.09,39.12 100.58,39.12
P1_3
  Bottom 0.254: U$2.P$12 60.22,23.9 61.21,24.89 61.21,25.91 62.23,26.92 62.23,28.45 63.25,29.46 63.25,32.51 69.09,38.35 100.58,38.35
P1_5
  Bottom 0.254: U$2.P$10 59.88,26.1 61.21,27.43 61.21,28.96 62.23,29.97 62.23,33.02 69.09,39.88 100.58,39.88
P1_7
  Bottom 0.254: U$2.P$24 57.86,22.3 58.67,23.11 60.2,23.11 61.72,24.64 61.72,25.65 62.74,26.67 62.74,28.19 63.75,29.21 63.75,32.26 69.09,37.59 100.58,37.59
P2_0  (via drill 0.6)
  Top 0.254: v53.09,24.38 53.34,24.38 55.12,22.61 57.4,22.61 61.21,26.42 v63.5,26.42
  Bottom 0.254: U$2.P$27 53.44,24.03 v53.09,24.38 | v63.5,26.42 64.01,26.42 67.31,29.72 67.31,33.53 69.09,35.31 100.58,35.31
P2_4  (via drill 0.6)
  Top 0.254: v51.31,24.38 51.56,24.38 53.85,22.1 57.66,22.1 60.71,25.15 v63.25,25.15
  Bottom 0.254: U$2.P$28 52.34,23.36 v51.31,24.38 | v63.25,25.15 63.5,25.15 67.82,29.46 67.82,33.27 69.09,34.54 100.58,34.54
P3_1
  Bottom 0.254: U$2.P$21 42.61,26.1 41.91,25.4 41.91,24.13 45.21,20.83 67.56,20.83 71.12,24.38 79.5,24.38 85.09,29.97 100.58,29.97
P3_2
  Bottom 0.254: U$2.P$20 41.93,27.2 41.15,26.42 41.15,24.13 44.96,20.32 67.82,20.32 71.37,23.88 79.76,23.88 85.09,29.21 100.58,29.21
P3_3
  Bottom 0.254: U$2.P$19 38.2,28.3 37.85,27.94 37.85,26.67 44.7,19.81 68.07,19.81 71.63,23.37 80.01,23.37 85.09,28.45 100.58,28.45
P3_4
  Bottom 0.254: U$2.P$18 38.29,29.4 37.34,28.45 37.34,26.42 44.45,19.3 68.33,19.3 71.88,22.86 80.26,22.86 85.09,27.69 100.58,27.69
P3_6
  Bottom 0.254: U$2.P$17 38.63,30.5 36.58,28.45 36.58,26.42 44.2,18.8 68.58,18.8 72.14,22.35 80.52,22.35 85.09,26.92 100.58,26.92
P3_7
  Bottom 0.254: U$2.P$16 38.96,31.6 36.07,28.7 36.07,26.16 43.94,18.29 68.83,18.29 72.39,21.84 80.77,21.84 85.09,26.16 100.58,26.16
RCK  (via drill 0.6)
  Top 0.254: v20.07,4.57 v26.16,4.57 | v37.08,5.08 37.85,5.08 38.35,4.57 v41.4,4.57 | v72.14,4.57 v78.99,4.57 80.26,4.57 81.53,5.84 81.53,10.92 86.11,15.49 86.11,17.78 v89.15,20.83
  Bottom 0.254: U$4.12 12.26,5.77 13.72,4.32 19.81,4.32 v20.07,4.57 | U$1.12 22.68,6.28 24.64,4.32 25.65,4.32 25.91,4.57 v26.16,4.57 36.58,4.57 v37.08,5.08 | U$3.12 41.08,10.34 40.39,9.65 40.39,5.33 41.15,4.57 v41.4,4.57 v72.14,4.57 | v78.99,4.57 77.22,4.57 76.96,4.83 76.96,7.14 U$5.12 | v89.15,20.83 100.58,20.83
RST_N  (via drill 0.6)
  Top 0.254: v48.77,21.84 49.53,21.08 57.91,21.08 60.45,23.62 61.72,23.62 v62.23,24.13
  Bottom 0.254: U$2.P$30 49.22,22.3 v48.77,21.84 | 100.58,33.78 85.09,33.78 78.49,27.18 70.1,27.18 67.31,24.38 63.25,24.38 62.99,24.13 v62.23,24.13
RXD  (via drill 0.6)
  Top 0.254: v44.7,23.62 44.7,20.32 46.48,18.54 58.67,18.54 v61.47,21.34
  Bottom 0.254: U$2.P$23 44.98,23.9 v44.7,23.62 | v61.47,21.34 62.48,22.35 67.56,22.35 70.61,25.4 78.99,25.4 85.09,31.5 100.58,31.5
SCK  (via drill 0.6)  (1 unrouted)
  Top 0.254: v18.8,6.35 20.57,6.35 v23.37,9.14 | v37.85,9.14 44.45,9.14 v44.96,9.65 | v78.49,8.89 78.49,9.91 84.33,15.75 84.33,19.56 v87.12,22.35
  Bottom 0.254: U$4.11 12.91,5.88 13.97,4.83 17.27,4.83 v18.8,6.35 | U$1.11 23.37,7.5 v23.37,9.14 v37.85,9.14 | U$3.11 42.56,9.65 v44.96,9.65 44.96,8.13 47.24,5.84 70.36,5.84 74.93,10.41 77.22,10.41 77.72,9.91 77.72,7.25 | 77.72,7.25 U$5.11 77.72,7.25 | 77.72,8.64 78.23,8.64 v78.49,8.89 | v87.12,22.35 100.58,22.35
SCLR  (via drill 0.6)
  Top 0.254: v16.76,6.1 17.53,5.33 24.38,5.33 v25.4,6.35 26.67,6.35 28.96,4.06 34.04,4.06 36.32,6.35 v42.42,6.35 | v72.64,5.84 79.76,5.84 v80.01,5.59 80.01,10.41 85.09,15.49 85.09,18.54 v88.14,21.59
  Bottom 0.254: U$4.10 13.56,6 14.22,5.33 16,5.33 v16.76,6.1 | U$1.10 23.98,6.5 25.15,5.33 25.4,5.59 v25.4,6.35 | U$5.10 78.33,5.49 78.49,5.33 79.76,5.33 v80.01,5.59 | U$3.10 41.55,9.04 41.4,8.89 41.4,7.11 42.16,6.35 v42.42,6.35 44.45,6.35 45.47,5.33 72.14,5.33 v72.64,5.84 | v88.14,21.59 100.58,21.59
SW_BTN
  Bottom 0.254: U$2.P$3 60.72,33.8 69.09,42.16 100.58,42.16
TXD  (via drill 0.6)
  Top 0.254: v43.43,24.13 43.43,20.83 46.23,18.03 59.44,18.03 v62.99,21.59
  Bottom 0.254: U$2.P$22 44.3,25 v43.43,24.13 | v62.99,21.59 67.56,21.59 70.87,24.89 79.25,24.89 85.09,30.73 100.58,30.73
VCC  (via drill 0.6)
  Top 0.254: v9.65,5.59 8.89,5.59 8.38,6.1 8.38,8.38 | v18.29,7.87 18.29,8.13 17.78,8.64 | v72.9,7.11 69.85,7.11 v69.09,7.87 | v62.74,7.11 59.44,7.11 v57.15,9.4 | v54.61,9.4 47.5,9.4 44.2,12.7 v40.39,12.7 | v28.45,8.13 30.73,10.41 | v25.91,7.62 25.91,7.87 25.4,8.38
  Top 0.61: 30.73,10.41 v32.77,10.41 | v35.81,10.16 35.81,10.67 37.85,12.7 v40.39,12.7
  Bottom 0.254: U$4.16 9.66,5.6 v9.65,5.59 | U$3.16 40.63,12.94 v40.39,12.7 | U$1.16 18.7,7.46 v18.29,7.87 | U$5.16 73.5,7.21 v72.9,7.11 | v69.09,7.87 63.5,7.87 v62.74,7.11 | v57.15,9.4 v54.61,9.4 | v28.45,8.13 26.42,8.13 v25.91,7.62
  Bottom 0.61: v32.77,10.41 35.56,10.41 v35.81,10.16
  pour Top: 101.09,2.79 0,2.79 0,43.94 101.09,43.94
VDD  (via drill 0.6)
  Top 0.254: C8.1 57.34,34.36 v57.4,34.29
  Bottom 0.254: v57.4,34.29 57.66,34.29 58.17,34.8 59.14,34.8 U$2.P$2
WAKEUP
  Bottom 0.254: U$2.P$7 60.13,29.4 60.96,30.23 60.96,33.27 69.09,41.4 100.58,41.4
(copper drawn outside any net)
  shapes: Bottom area x1